# EasyEDA Pro project 一分二分电板.epro

# Schematic Schematic2
Create Date: 2024-05-03; Page Name: P1; Project Name: 一分二; Schematic Name: Schematic2; Update Date: 2024-05-03; Company: 嘉立创EDA; Page Size: A4; Version: V1.0
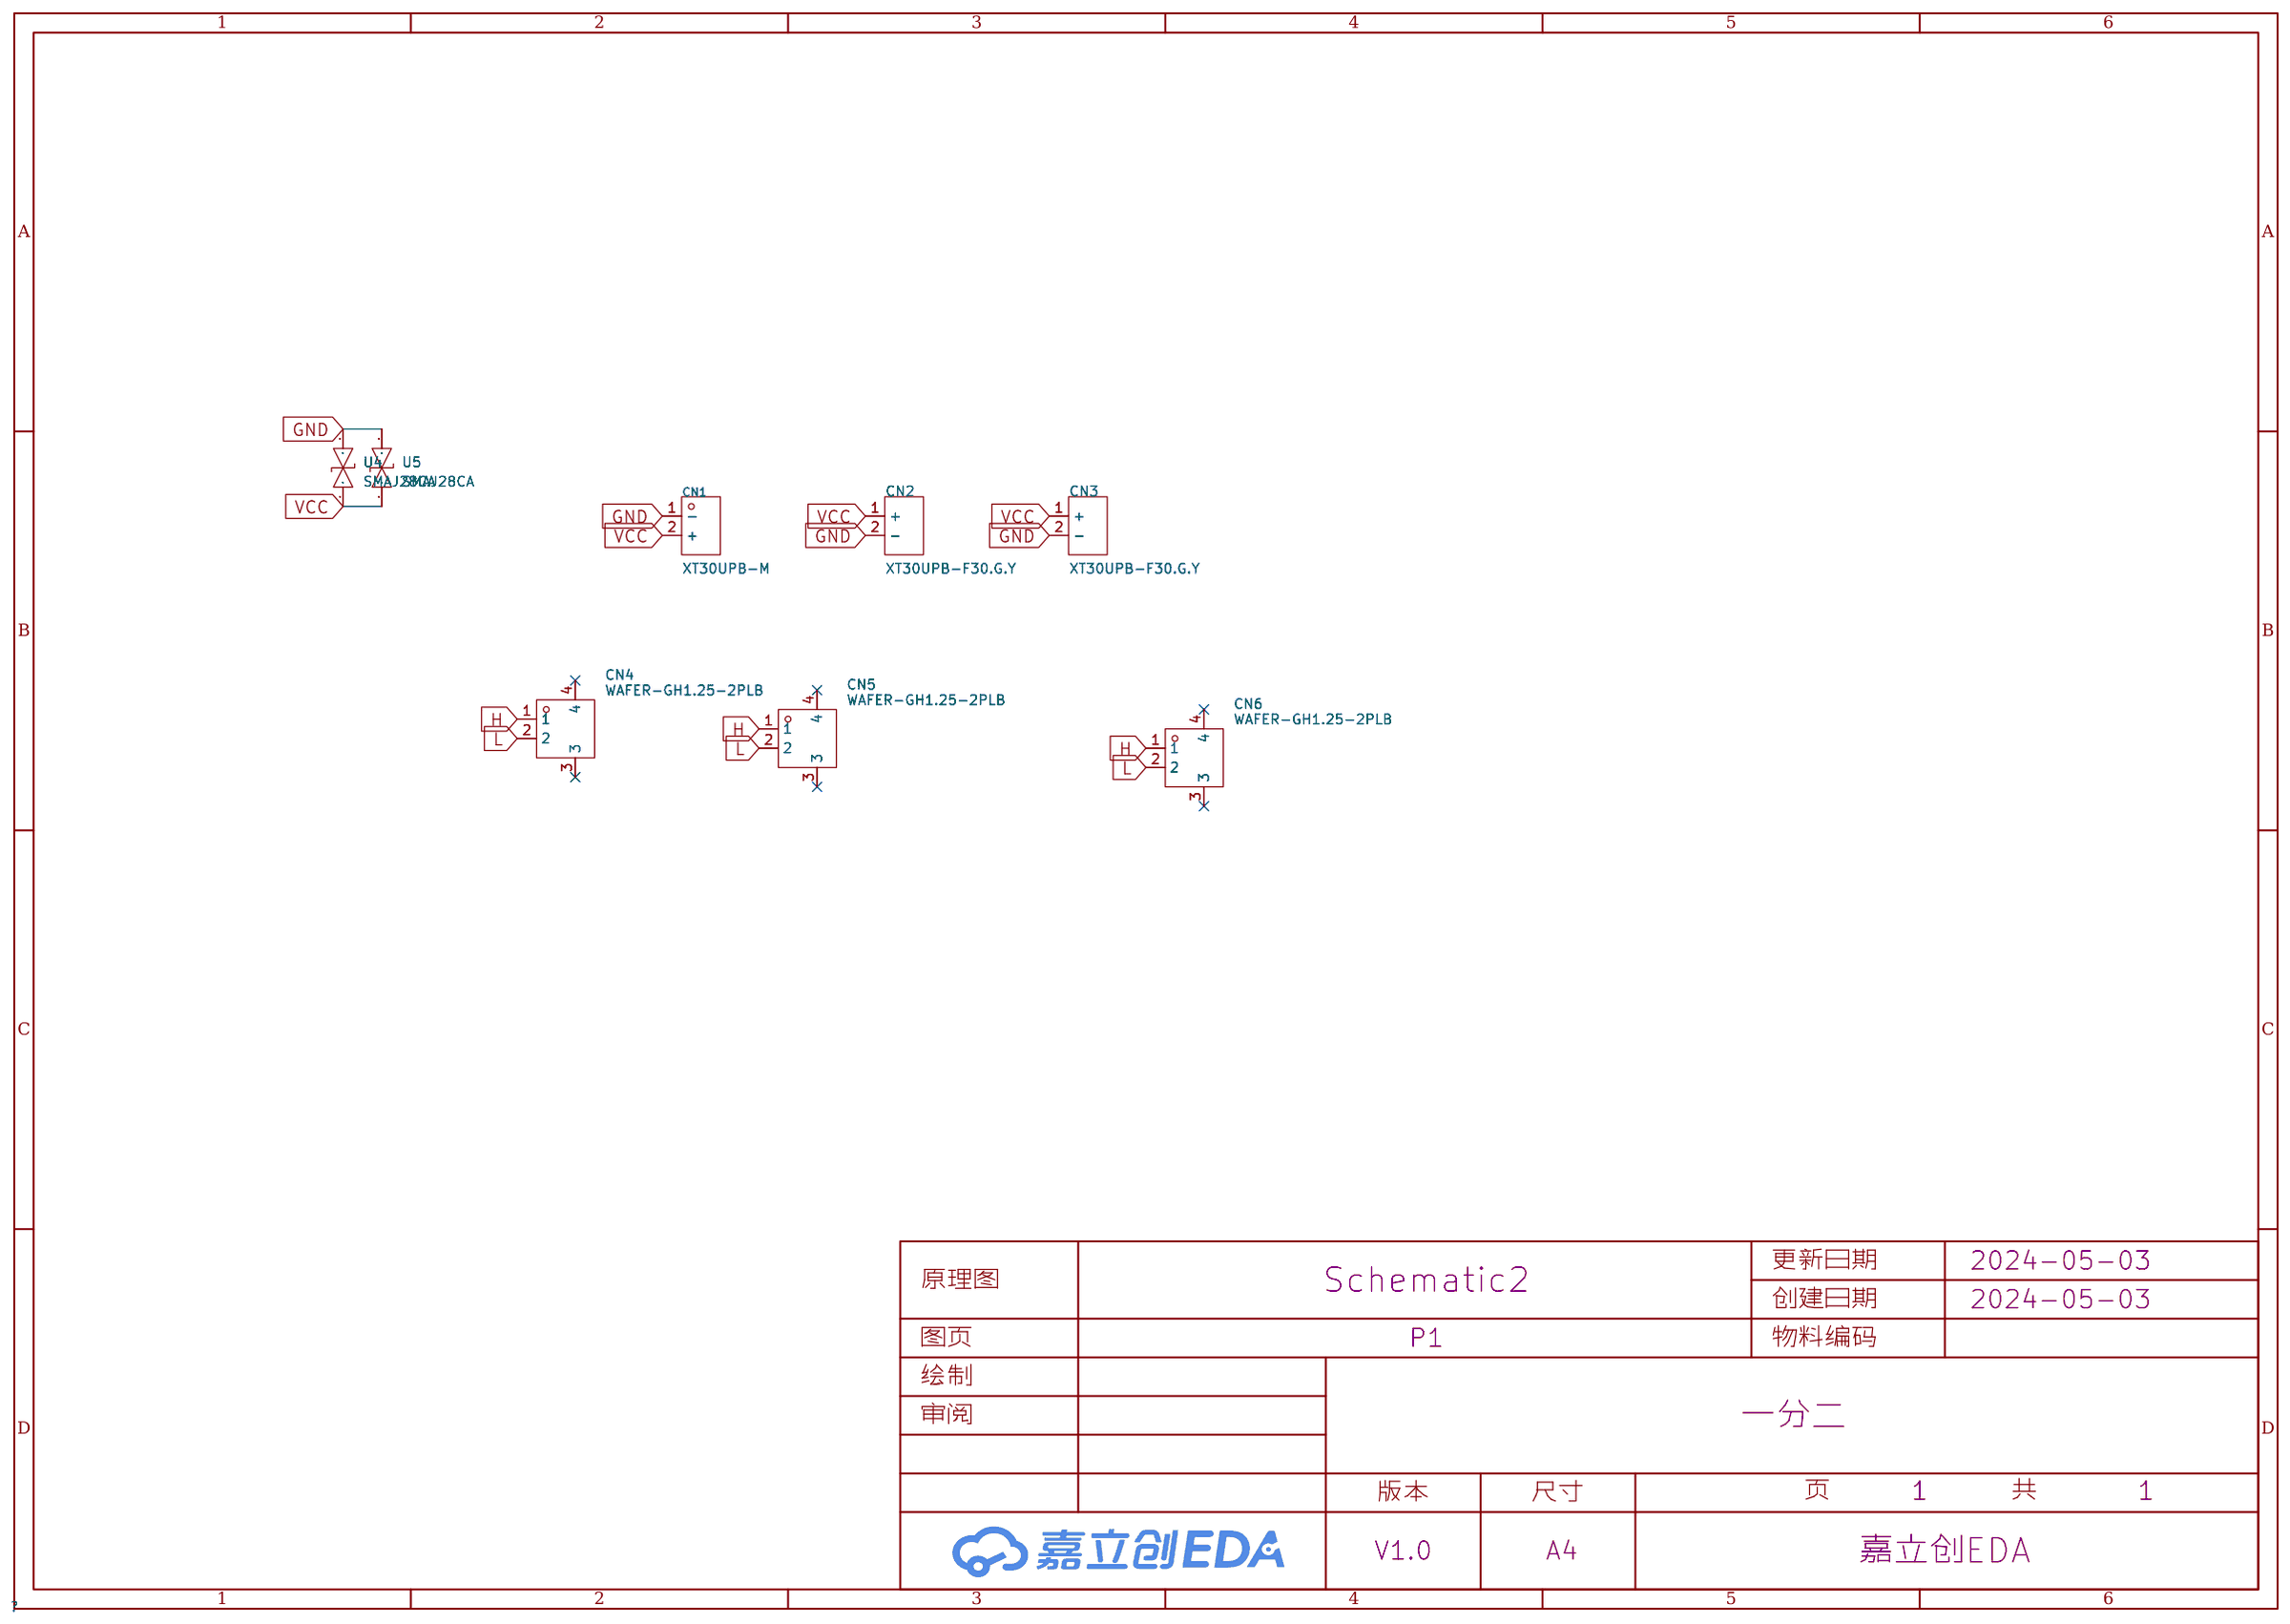
[diagram p0: schematic sheet]

## Parts
CN1  XT30UPB-M  [CONN-TH_XT30UPB-M]
CN2  XT30UPB-F30.G.Y  [CONN-TH_XT30UPB-F]
CN3  XT30UPB-F30.G.Y  [CONN-TH_XT30UPB-F]
CN4  WAFER-GH1.25-2PLB  [CONN-TH_2P-P1.25_XUNPU_WAFER-GH1.25-2PLB]
CN5  WAFER-GH1.25-2PLB  [CONN-TH_2P-P1.25_XUNPU_WAFER-GH1.25-2PLB]
CN6  WAFER-GH1.25-2PLB  [CONN-TH_2P-P1.25_XUNPU_WAFER-GH1.25-2PLB]
U4  SMAJ28CA  [SMA_L4.3-W2.7-LS5.0-BI]
U5  SMAJ28CA  [SMA_L4.3-W2.7-LS5.0-BI]

## Library data of the parts
CN1 = XT30UPB-M: 类别:-;类型1:-;; LCSC Part Name: AMASS(艾迈斯)板载立式 航模锂电池控制器连接器插头 公头XT30UPB-M; Supplier Part: C428721; Manufacturer: AMASS(艾迈斯); JLCPCB Part Class: 扩展库; Datasheet: https://atta.szlcsc.com/upload/public/pdf/source/20230412/7B5DFEF57C9EA5273853390C734B3AC5.pdf; Supplier: LCSC; Brand: 艾迈斯; Type: 航模插头; Colour: 黄色; RatedVoltage: DC 500V; InterfaceType: 公头; MetalMaterial: 镀金; InsulationMaterial: PA; RatedCurrent: 15A; contact resistance: 0.65mΩ
CN2 CN3 = XT30UPB-F30.G.Y: 类别:-;类型1:-;; LCSC Part Name: AMASS(艾迈斯)直立焊板式连接器XT30UPB30-F.G.*; Supplier Part: C108769; Manufacturer: AMASS(艾迈斯); JLCPCB Part Class: 扩展库; Datasheet: https://atta.szlcsc.com/upload/public/pdf/source/20220715/AFD68B9E8B6CA95A7295DBF4AF9325E4.pdf; Supplier: LCSC; Brand: 艾迈斯; Type: 航模插头; Colour: 黄色; RatedVoltage: DC 500V; InterfaceType: 母头; MetalMaterial: 镀金; InsulationMaterial: PA; RatedCurrent: 15A; contact resistance: 0.65mΩ
CN4-CN6 = WAFER-GH1.25-2PLB: 插针结构:1x2P;间距:1.25mm;安装方式:立贴;参考系列:GH;总PIN数:2P;排数:1;每排PIN数:2;额定电流:1A;工作温度范围:-25℃~+85℃;; LCSC Part Name: 1x2P 间距:1.25mm 立贴 系列:GH; Supplier Part: C3029368; Manufacturer: XUNPU(讯普); Supplier Footprint: SMD,P=1.25mm; JLCPCB Part Class: 扩展库; Datasheet: https://atta.szlcsc.com/upload/public/pdf/source/20220527/44F824AAC8C2B617205E15955FF9C23D.pdf; Supplier: LCSC; Pins Structure: 1x2P; Pitch: 1.25mm; Mounting Style: 立贴; Reference Series: GH; Number of Pins: 2P; Number of Rows: 1; Number of PINs Per Row: 2; Current Rating (Max): 1A; Operating Temperature Range: -25℃~+85℃
U4 U5 = SMAJ28CA_C908827: 反向截止电压(Vrwm):28V;最大钳位电压:45.4V;峰值脉冲电流(Ipp)@10/1000us:8.8A;击穿电压:31.1V;; LCSC Part Name: 双向TVS 28V截止 8.8A峰值脉冲; Supplier Part: C908827; Manufacturer: GOODWORK(固得沃克); Supplier Footprint: SMA(DO-214AC); JLCPCB Part Class: 扩展库; Datasheet: https://atta.szlcsc.com/upload/public/pdf/source/20201231/C908757_5436EAF671B686EFC2F0DD2098F0ED89.pdf; Supplier: LCSC; Reverse Stand-Off Voltage (Vrwm): 28V; Maximum Clamping Voltage: 45.4V; Peak Pulse Current (Ipp)@10/1000us: 8.8A; Breakdown Voltage: 31.1V; Reverse Leakage Current (Ir): 5uA; Type: TVS

## Nets
GND: CN1.1(-) CN2.2(-) CN3.2(-) U4.2 U5.2
VCC: CN1.2(+) CN2.1(+) CN3.1(+) U4.1 U5.1
H: CN4.1 CN5.1 CN6.1
L: CN4.2 CN5.2 CN6.2

Not connected (* = marked no-connect by the designer): CN4 3* 4*; CN5 3* 4*; CN6 3* 4*

# Schematic Schematic3
Board Name: 一分二都在同一面; Create Date: 2024-05-03; Page Name: P1; Project Name: 一分二; Schematic Name: Schematic3; Update Date: 2024-05-03; Company: 嘉立创EDA; Page Size: A4; Version: V1.0
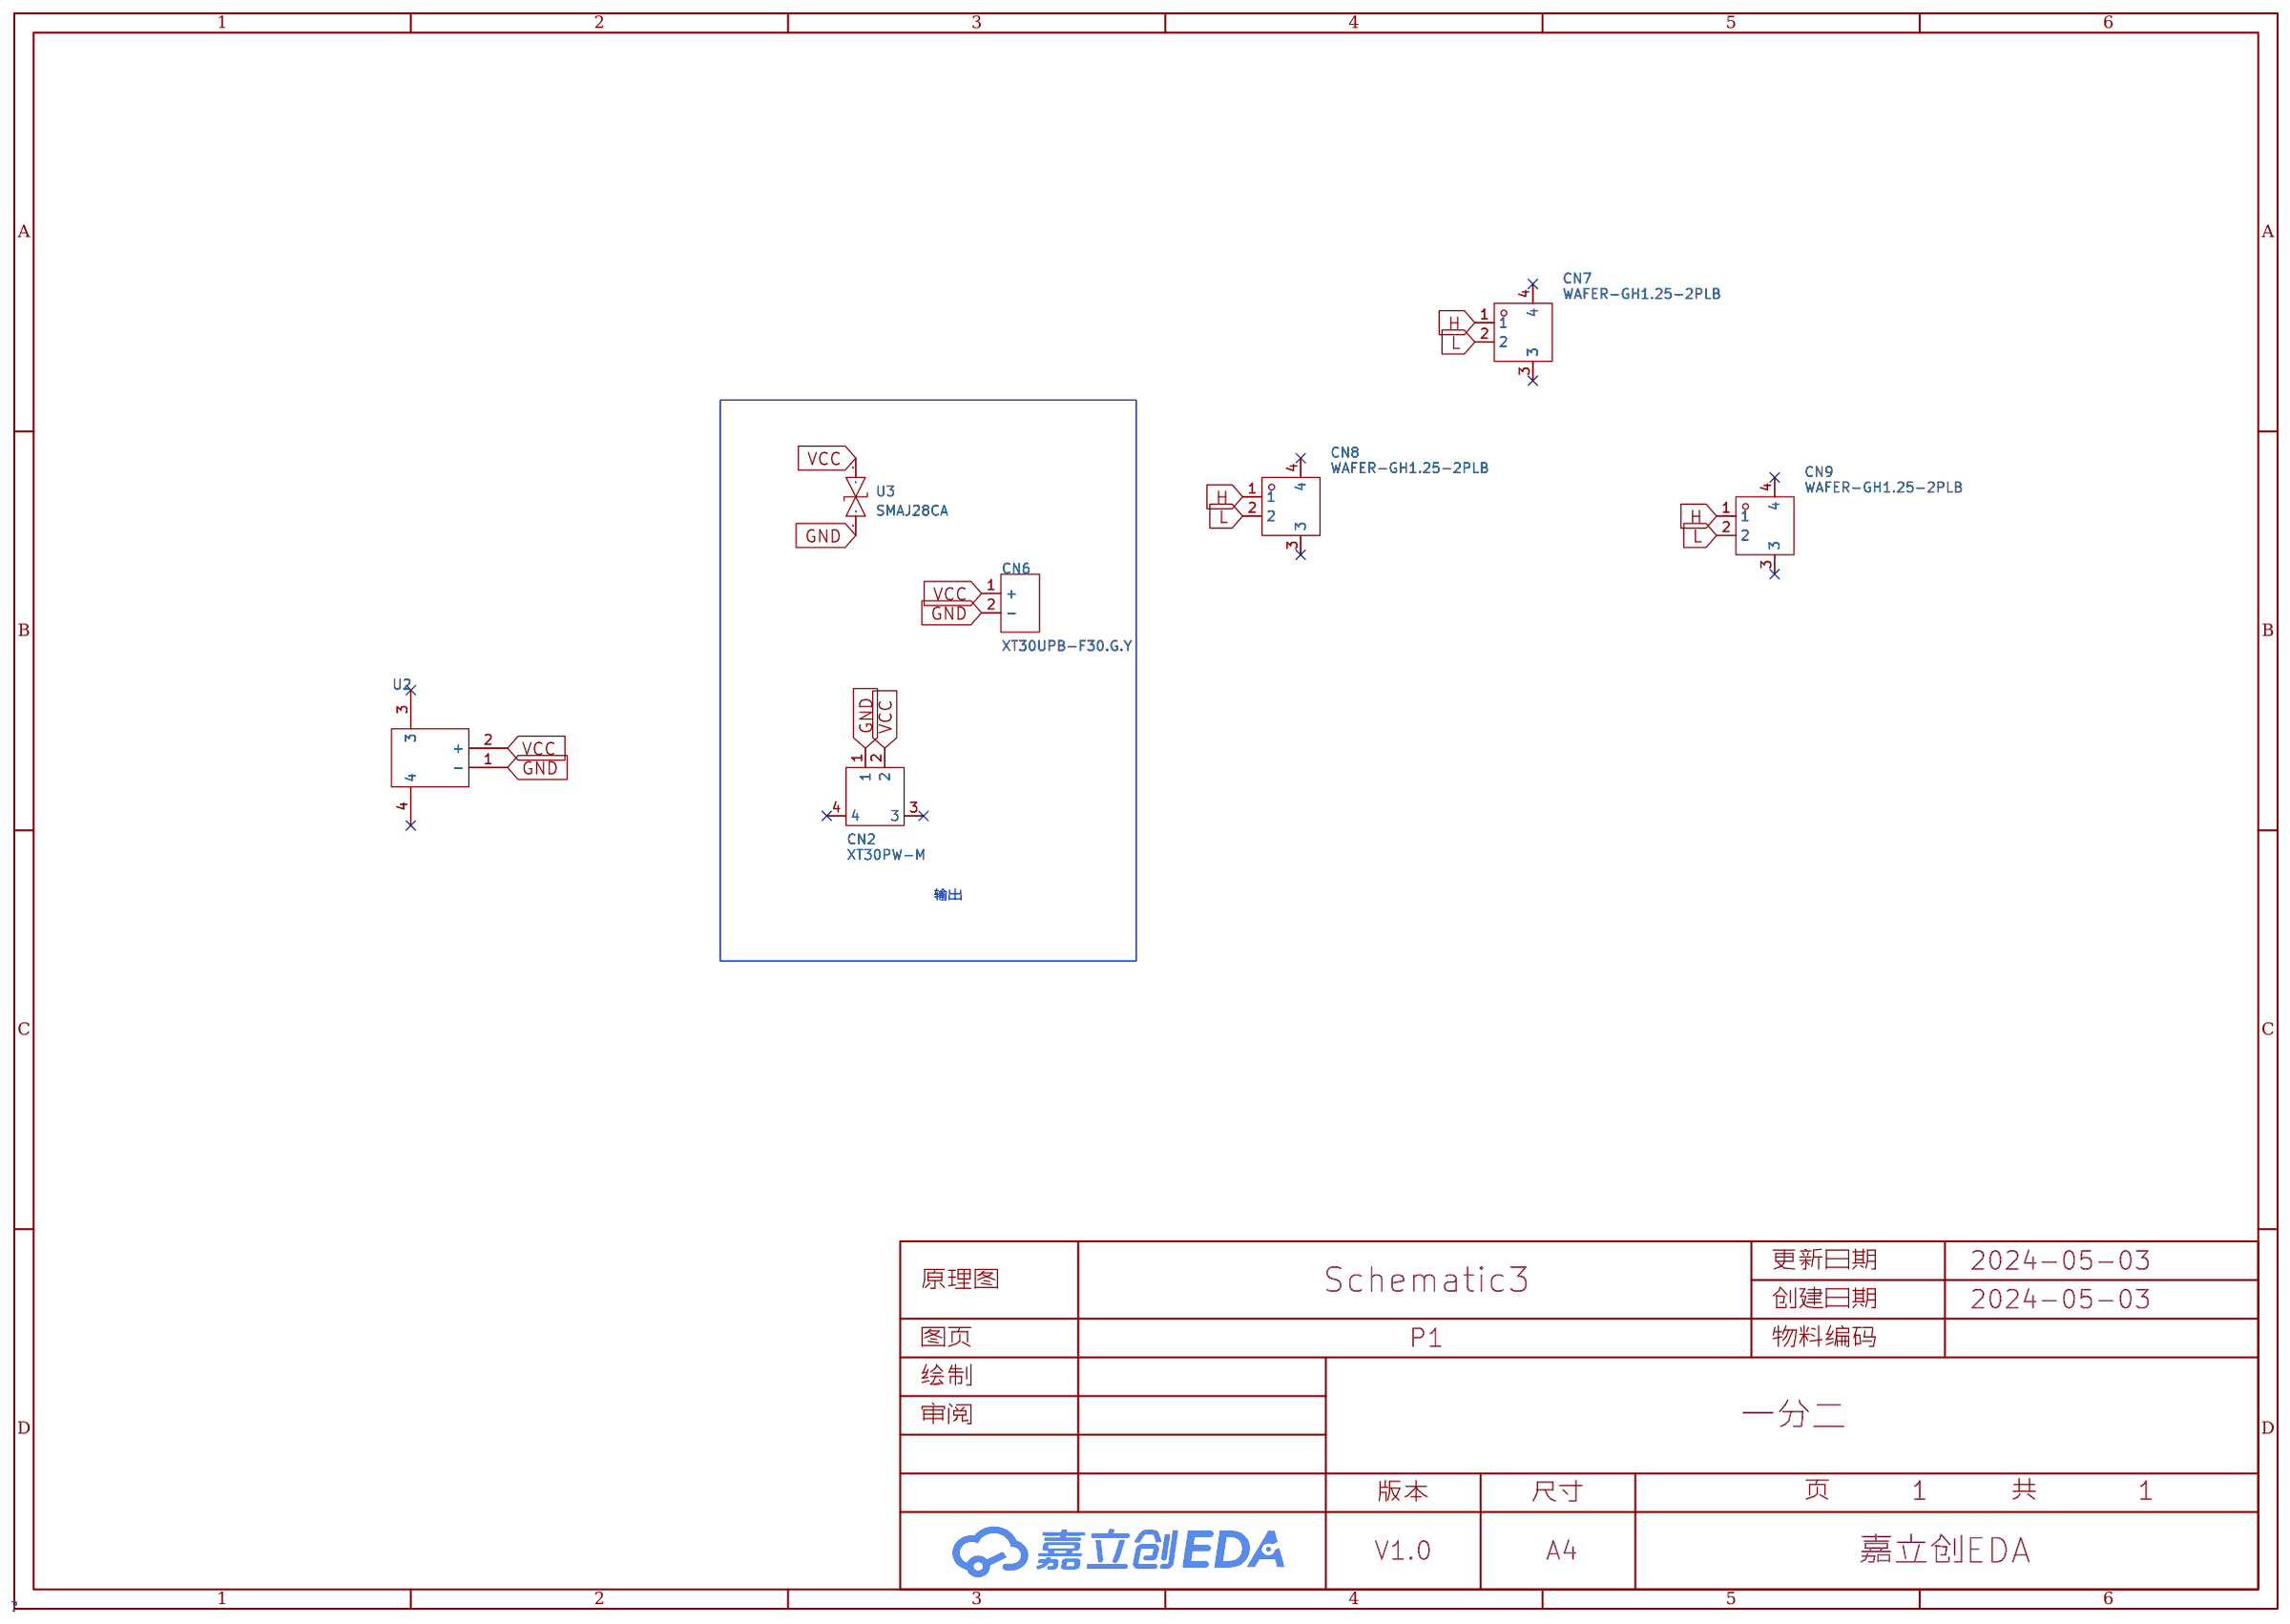
[diagram p1: schematic sheet]

## Parts
CN2  XT30PW-M  [CONN-TH_XT30PW-M]
CN6  XT30UPB-F30.G.Y  [CONN-TH_XT30UPB-F]
CN7  WAFER-GH1.25-2PLB  [CONN-TH_2P-P1.25_XUNPU_WAFER-GH1.25-2PLB]
CN8  WAFER-GH1.25-2PLB  [CONN-TH_2P-P1.25_XUNPU_WAFER-GH1.25-2PLB]
CN9  WAFER-GH1.25-2PLB  [CONN-TH_2P-P1.25_XUNPU_WAFER-GH1.25-2PLB]
U2  -  [xt30卧式母头]
U3  SMAJ28CA  [SMA_L4.3-W2.7-LS5.0-BI]

## Library data of the parts
CN2 = XT30PW-M: 类别:-;类型1:-;; LCSC Part Name: AMASS(艾迈斯)航模插头 卧式弯脚 XT30PW-M公头; Supplier Part: C431092; Manufacturer: AMASS(艾迈斯); JLCPCB Part Class: 扩展库; Datasheet: https://atta.szlcsc.com/upload/public/pdf/source/20220222/6A9F22F7850E25B33E1BE430ADF8560B.pdf; Supplier: LCSC; Brand: 艾迈斯; Type: 航模插头; RatedVoltage: DC 500V; InterfaceType: 公头; RatedCurrent: 15A; RecommendedWireGauge: 16/18/20AWG; contact resistance: 1.2mΩ; specifications: 2pin
CN6 = XT30UPB-F30.G.Y: 类别:-;类型1:-;; LCSC Part Name: AMASS(艾迈斯)直立焊板式连接器XT30UPB30-F.G.*; Supplier Part: C108769; Manufacturer: AMASS(艾迈斯); JLCPCB Part Class: 扩展库; Datasheet: https://atta.szlcsc.com/upload/public/pdf/source/20220715/AFD68B9E8B6CA95A7295DBF4AF9325E4.pdf; Supplier: LCSC; Brand: 艾迈斯; Type: 航模插头; Colour: 黄色; RatedVoltage: DC 500V; InterfaceType: 母头; MetalMaterial: 镀金; InsulationMaterial: PA; RatedCurrent: 15A; contact resistance: 0.65mΩ
CN7-CN9 = WAFER-GH1.25-2PLB: 插针结构:1x2P;间距:1.25mm;安装方式:立贴;参考系列:GH;总PIN数:2P;排数:1;每排PIN数:2;额定电流:1A;工作温度范围:-25℃~+85℃;; LCSC Part Name: 1x2P 间距:1.25mm 立贴 系列:GH; Supplier Part: C3029368; Manufacturer: XUNPU(讯普); Supplier Footprint: SMD,P=1.25mm; JLCPCB Part Class: 扩展库; Datasheet: https://atta.szlcsc.com/upload/public/pdf/source/20220527/44F824AAC8C2B617205E15955FF9C23D.pdf; Supplier: LCSC; Pins Structure: 1x2P; Pitch: 1.25mm; Mounting Style: 立贴; Reference Series: GH; Number of Pins: 2P; Number of Rows: 1; Number of PINs Per Row: 2; Current Rating (Max): 1A; Operating Temperature Range: -25℃~+85℃
U2 = xt30卧式母头
U3 = SMAJ28CA_C908827: 反向截止电压(Vrwm):28V;最大钳位电压:45.4V;峰值脉冲电流(Ipp)@10/1000us:8.8A;击穿电压:31.1V;; LCSC Part Name: 双向TVS 28V截止 8.8A峰值脉冲; Supplier Part: C908827; Manufacturer: GOODWORK(固得沃克); Supplier Footprint: SMA(DO-214AC); JLCPCB Part Class: 扩展库; Datasheet: https://atta.szlcsc.com/upload/public/pdf/source/20201231/C908757_5436EAF671B686EFC2F0DD2098F0ED89.pdf; Supplier: LCSC; Reverse Stand-Off Voltage (Vrwm): 28V; Maximum Clamping Voltage: 45.4V; Peak Pulse Current (Ipp)@10/1000us: 8.8A; Breakdown Voltage: 31.1V; Reverse Leakage Current (Ir): 5uA; Type: TVS

## Nets
GND: CN2.1 CN6.2(-) U2.1(-) U3.1
VCC: CN2.2 CN6.1(+) U2.2(+) U3.2
H: CN7.1 CN8.1 CN9.1
L: CN7.2 CN8.2 CN9.2

Not connected (* = marked no-connect by the designer): CN2 3* 4*; CN7 3* 4*; CN8 3* 4*; CN9 3* 4*; U2 3* 4*

## Notes on the sheet
- 输出

# Board PCB3
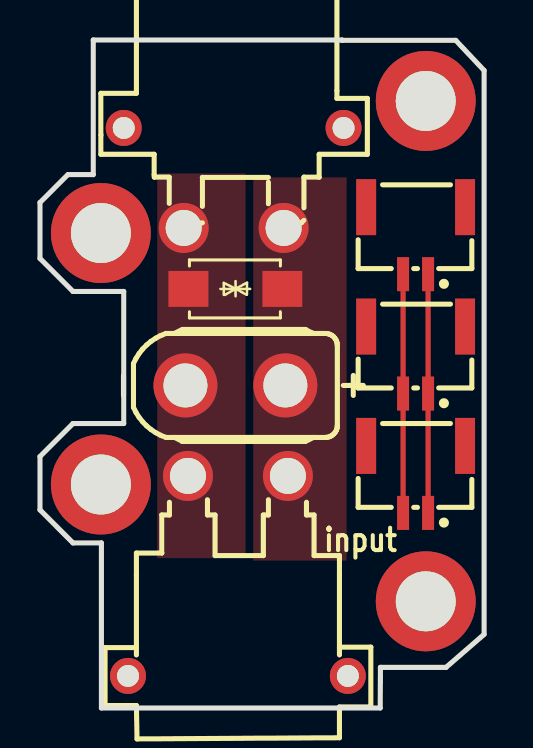
[diagram p2: board, top side]
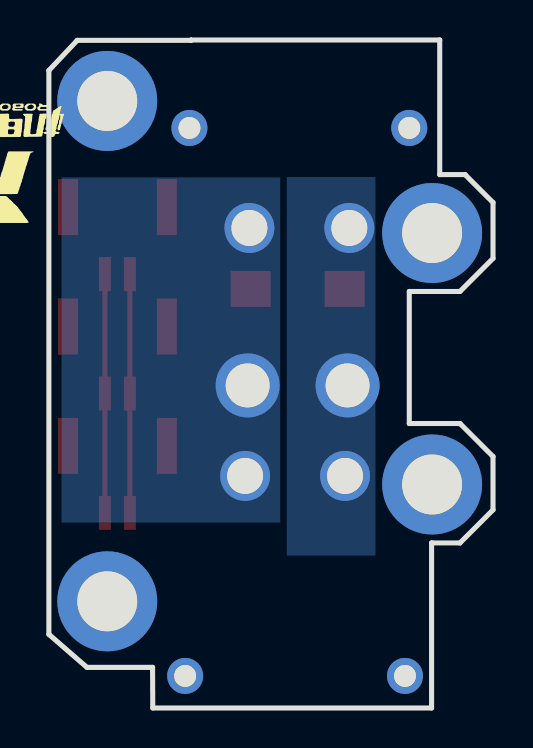
[diagram p3: board, bottom side, seen from below]

Outline 22.23 x 33.4 mm; copper layers: Top Layer, Bottom Layer. Coordinates in mm from the lower left corner of the outline.
Outline path: 0,25.27 1.4,26.67 2.67,26.67 2.67,33.4 15.11,33.4 15.11,33.38 20.8,33.38 22.23,31.88 22.23,3.68 20.32,2.03 17.04,2.03 17.03,0 3.07,0 3.07,8.25 1.65,8.25 0,9.91 0,12.57 1.65,14.22 4.19,14.22 4.19,20.83 1.65,20.83 0,22.48 0,25.27
Stack: Top Layer 0.035mm / Dielectric1 1.51mm FR4 er 4.5 / Bottom Layer 0.035mm

## Design rules (mm)
template: JLCPCB Capability(Two Layers Board)
spacing copperThickness1oz (default): track to track 0.102, other pairs 0.152 to 0.3
spacing copperThickness2oz: track to track 0.203, other pairs 0.152 to 0.3
track width copperThickness1oz (default): min 0.127, default 0.254, max 2.54
track width copperThickness2oz: min 0.203, default 0.254, max 2.54
differential pair differentialPair (default): width min 0.127, default 0.254, max 2.54; gap min 0.152, default 0.152
via viaSize (default): diameter min 0.5, default 0.61, max 10; hole min 0.3, default 0.305, max 6.3

## Placement (name value [footprint] x y rotation side)
CN2  XT30PW-M  [CONN-TH_XT30PW-M]  9.91 6.6 0 top
CN6  XT30UPB-F30.G.Y  [CONN-TH_XT30UPB-F]  9.78 16.13 180 top
CN7  WAFER-GH1.25-2PLB  [CONN-TH_2P-P1.25_XUNPU_WAFER-GH1.25-2PLB]  18.8 23.37 180 top
CN8  WAFER-GH1.25-2PLB  [CONN-TH_2P-P1.25_XUNPU_WAFER-GH1.25-2PLB]  18.8 17.4 180 top
CN9  WAFER-GH1.25-2PLB  [CONN-TH_2P-P1.25_XUNPU_WAFER-GH1.25-2PLB]  18.8 11.43 180 top
NOREF  -  [Pad_e10]  19.3 30.35 0 top
NOREF#2  -  [Pad_e11]  19.3 5.33 0 top
NOREF#3  -  [Pad_e7]  3.05 23.75 0 top
NOREF#4  -  [Pad_e9]  3.05 11.18 0 top
U2  -  [xt30卧式母头]  11.81 28.7 270 top
U3  SMAJ28CA  [SMA_L4.3-W2.7-LS5.0-BI]  9.78 20.95 0 top

## Footprints (pads in the part's own frame, mm; a bottom-side part is the same pattern mirrored in y, then rotated)
CONN-TH_2P-P1.25_XUNPU_WAFER-GH1.25-2PLB
  rect 0.6x1.7 smd: 1(-0.625,1.675) 2(0.625,1.675)
  rect 1x2.8 smd: 3(2.475,-1.675) 4(-2.475,-1.675)
CONN-TH_XT30PW-M
  round 2.5 hole 1.8: 1(-2.5,5) 2(2.5,5)
  round 1.8 hole 1.1: 3(5.5,-5) 4(-5.5,-5)
CONN-TH_XT30UPB-F
  round 3.2 hole 2.2: 1(-2.5,0) 2(2.5,0)
Pad_e7
  round 5 hole 3: 5(0,0)
Pad_e9
  round 5 hole 3: 5(0,0)
Pad_e10
  round 5 hole 3: 5(0,0)
Pad_e11
  round 5 hole 3: 5(0,0)
SMA_L4.3-W2.7-LS5.0-BI
  rect 2x1.8 smd: 1(-2.35,0) 2(2.35,0)
xt30卧式母头
  round 2.5 hole 1.8: 1(4.699,-4.619) 2(4.699,0.381)
  round 1.8 hole 1.1: 3(-0.301,3.381) 4(-0.301,-7.619)

## Nets
As in the schematic.

Pads without a net: CN2 3 4; CN7 3 4; CN8 3 4; CN9 3 4; NOREF 5; NOREF#2 5; NOREF#3 5; NOREF#4 5; U2 3 4

## Routing (per net, layer and track width the routed paths; a pad name or vN(x,y) marks a point on that pad's centre or on a via; arc(x,y) is an arc through that point)
H: length 12.1
  Top Layer w0.254: CN7.1 19.42,9.73 19.55,9.6
L: length 12.1
  Top Layer w0.254: 18.3,9.6 18.17,9.73 CN7.2

## Copper pours and planes (outline as drawn; the poured copper is in the pictures)
GND on Top Layer: 5.87,26.73 10.29,26.73 10.29,7.49 5.87,7.49
GND on Bottom Layer: 5.88,26.54 10.32,26.54 10.32,7.62 5.88,7.62
VCC on Top Layer: 10.67,26.53 15.34,26.53 15.34,7.37 10.67,7.37
VCC on Bottom Layer: 10.65,26.53 21.59,26.53 21.59,9.27 10.65,9.27

## Text on the board
Top Silkscreen Layer: input

# Board PCB2
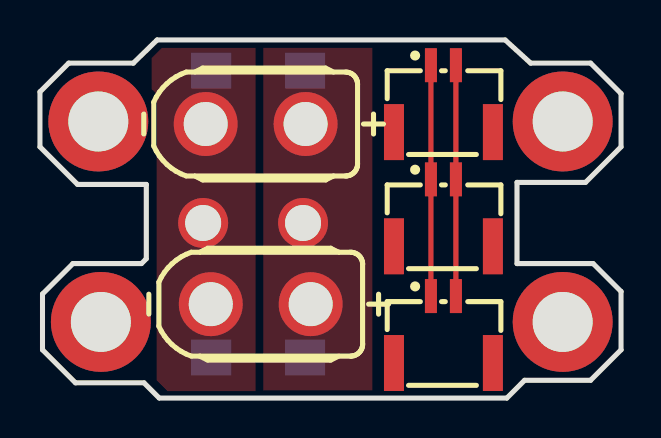
[diagram p4: board, top side]
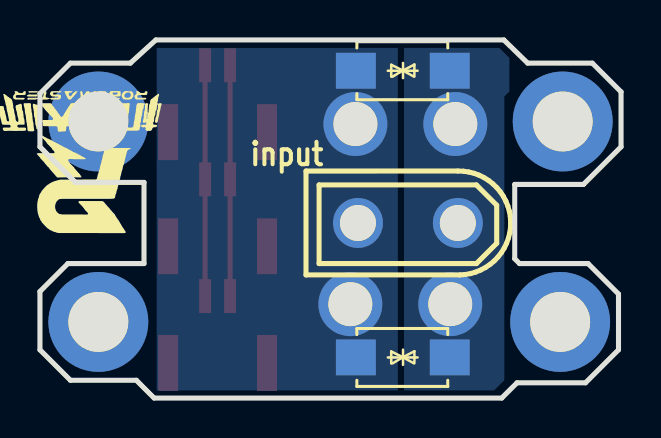
[diagram p5: board, bottom side, seen from below]

Outline 29.08 x 17.92 mm; copper layers: Top Layer, Bottom Layer. Coordinates in mm from the lower left corner of the outline.
Outline path: 0,15.33 1.44,16.76 4.67,16.76 5.86,17.92 23.28,17.92 24.56,16.76 27.56,16.76 29.08,15.24 29.08,12.57 27.3,10.8 23.88,10.8 23.88,6.73 27.69,6.73 29.08,5.33 29.08,2.41 27.56,0.89 24.26,0.89 23.37,0 5.97,0 5.21,0.76 1.78,0.76 0.13,2.41 0.13,5.21 1.65,6.73 5.08,6.73 5.32,6.97 5.32,10.69 1.88,10.69 0,12.57 0,15.33
Stack: Top Layer 0.035mm / Dielectric1 1.51mm FR4 er 4.5 / Bottom Layer 0.035mm

## Design rules (mm)
template: JLCPCB Capability(Two Layers Board)
spacing copperThickness1oz (default): track to track 0.102, other pairs 0.152 to 0.3
spacing copperThickness2oz: track to track 0.203, other pairs 0.152 to 0.3
track width copperThickness1oz (default): min 0.127, default 0.254, max 2.54
track width copperThickness2oz: min 0.203, default 0.254, max 2.54
differential pair differentialPair (default): width min 0.127, default 0.254, max 2.54; gap min 0.152, default 0.152
via viaSize (default): diameter min 0.5, default 0.61, max 10; hole min 0.3, default 0.305, max 6.3

## Placement (name value [footprint] x y rotation side)
CN1  XT30UPB-M  [CONN-TH_XT30UPB-M]  10.67 8.76 0 bottom
CN2  XT30UPB-F30.G.Y  [CONN-TH_XT30UPB-F]  11.05 4.7 180 top
CN3  XT30UPB-F30.G.Y  [CONN-TH_XT30UPB-F]  10.79 13.72 180 top
CN4  WAFER-GH1.25-2PLB  [CONN-TH_2P-P1.25_XUNPU_WAFER-GH1.25-2PLB]  20.19 3.43 0 top
CN5  WAFER-GH1.25-2PLB  [CONN-TH_2P-P1.25_XUNPU_WAFER-GH1.25-2PLB]  20.19 9.27 0 top
CN6  WAFER-GH1.25-2PLB  [CONN-TH_2P-P1.25_XUNPU_WAFER-GH1.25-2PLB]  20.19 14.99 0 top
NOREF  -  [Pad_e10]  2.92 13.84 0 top
NOREF#2  -  [Pad_e14]  26.16 13.84 0 top
NOREF#3  -  [Pad_e13]  26.16 3.81 0 top
NOREF#4  -  [Pad_e12]  3.05 3.81 0 top
U4  SMAJ28CA  [SMA_L4.3-W2.7-LS5.0-BI]  10.92 2.03 180 bottom
U5  SMAJ28CA  [SMA_L4.3-W2.7-LS5.0-BI]  10.92 16.38 180 bottom

## Footprints (pads in the part's own frame, mm; a bottom-side part is the same pattern mirrored in y, then rotated)
CONN-TH_2P-P1.25_XUNPU_WAFER-GH1.25-2PLB
  rect 0.6x1.7 smd: 1(-0.625,1.675) 2(0.625,1.675)
  rect 1x2.8 smd: 3(2.475,-1.675) 4(-2.475,-1.675)
CONN-TH_XT30UPB-F
  round 3.2 hole 2.2: 1(-2.5,0) 2(2.5,0)
CONN-TH_XT30UPB-M
  round 2.5 hole 1.8: 1(-2.5,0) 2(2.5,0)
Pad_e10
  round 5 hole 3: 5(0,0)
Pad_e12
  round 5 hole 3: 5(0,0)
Pad_e13
  round 5 hole 3: 5(0,0)
Pad_e14
  round 5 hole 3: 5(0,0)
SMA_L4.3-W2.7-LS5.0-BI
  rect 2x1.8 smd: 1(-2.35,0) 2(2.35,0)

## Nets
As in the schematic.

Pads without a net: CN4 3 4; CN5 3 4; CN6 3 4; NOREF 5; NOREF#2 5; NOREF#3 5; NOREF#4 5

## Routing (per net, layer and track width the routed paths; a pad name or vN(x,y) marks a point on that pad's centre or on a via; arc(x,y) is an arc through that point)
H: length 11.6
  Top Layer w0.254: CN4.1 CN5.1 CN6.1
L: length 11.6
  Top Layer w0.254: CN4.2 CN5.2 CN6.2

## Copper pours and planes (outline as drawn; the poured copper is in the pictures)
GND on Top Layer: 5.59,17.53 10.79,17.53 10.79,0.35 5.59,0.35
GND on Bottom Layer: 5.59,17.53 10.86,17.53 10.86,0.38 5.59,0.38
VCC on Top Layer: 11.18,17.53 16.64,17.53 16.64,0.38 11.18,0.38
VCC on Bottom Layer: 11.18,17.53 23.24,17.53 23.24,0.38 11.18,0.38

## Text on the board
Bottom Silkscreen Layer: input
